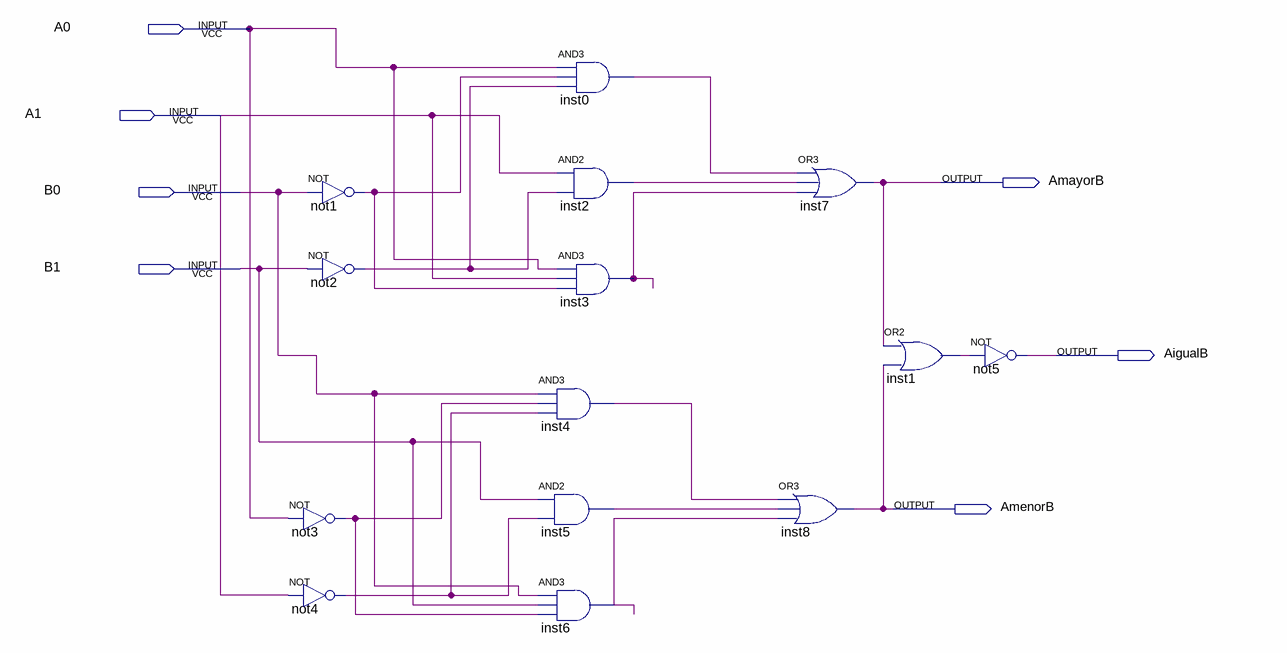
[diagram p0: schematic sheet]
// Quartus schematic Comparador.bdf as structural Verilog: 14 symbols, 7 pins
module Comparador (
  input  A0,
  input  A1,
  input  B0,
  input  B1,
  output AmayorB,
  output AigualB,
  output AmenorB
);

  wire inst0_out, inst1_out, inst2_out, inst3_out, inst4_out, inst5_out, inst6_out, not1_out, not2_out,
       not3_out, not4_out;

  not not1 (not1_out, B0);
  not not2 (not2_out, B1);
  not not3 (not3_out, A0);
  not not4 (not4_out, A1);
  and inst4 (inst4_out, B0, not3_out, not4_out);
  and inst5 (inst5_out, B1, not4_out);
  and inst6 (inst6_out, B0, B1, not3_out);
  and inst0 (inst0_out, A0, not1_out, not2_out);
  and inst2 (inst2_out, A1, not2_out);
  and inst3 (inst3_out, A0, A1, not1_out);
  or inst7 (AmayorB, inst0_out, inst2_out, inst3_out);
  or inst8 (AmenorB, inst4_out, inst5_out, inst6_out);
  or inst1 (inst1_out, AmayorB, AmenorB);
  not not5 (AigualB, inst1_out);
endmodule
